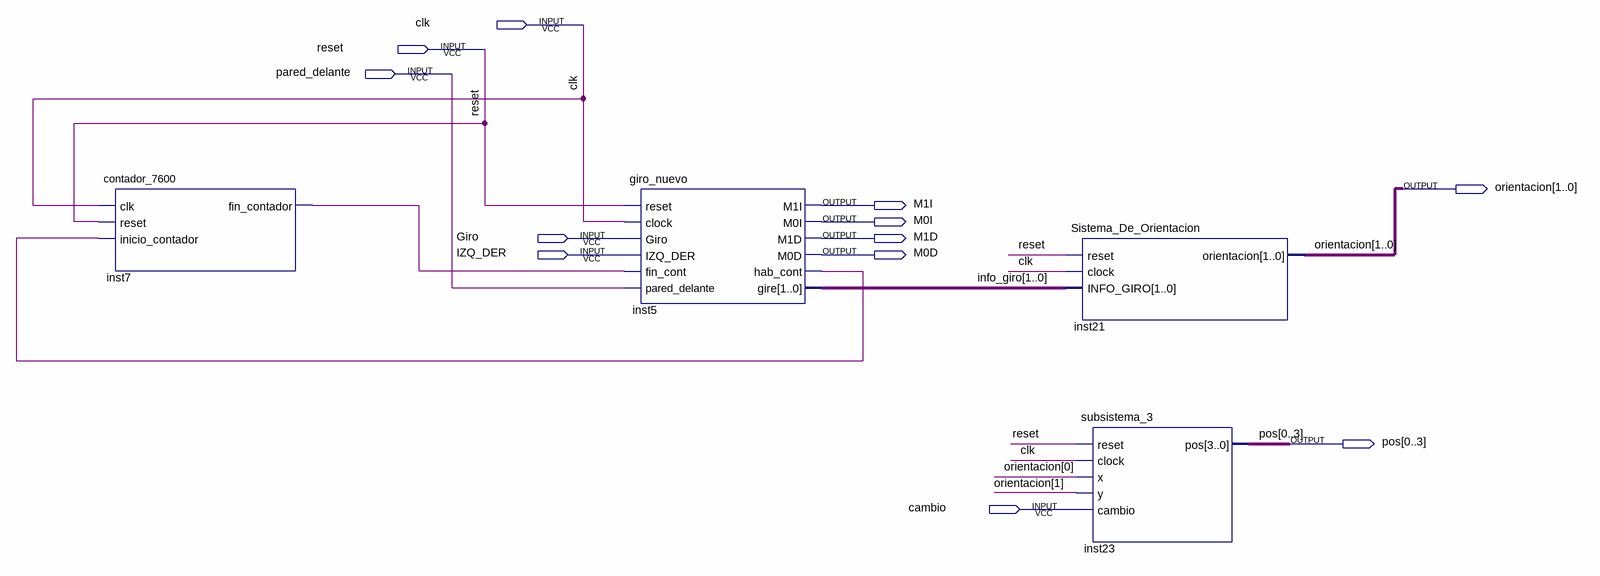
[diagram p0: schematic sheet]
// Quartus schematic prueba_giro.bdf as structural Verilog: 4 symbols, 12 pins
module prueba_giro (
  input  clk,
  input  reset,
  input  pared_delante,
  input  Giro,
  input  IZQ_DER,
  input  cambio,
  output [1:0] orientacion,
  output M1I,
  output M0I,
  output M1D,
  output M0D,
  output [0:3] pos
);

  wire inst5_hab_cont, inst7_fin_contador;
  wire [1:0] info_giro;

  contador_7600 inst7 (.clk(clk), .reset(reset), .inicio_contador(inst5_hab_cont), .fin_contador(inst7_fin_contador));
  giro_nuevo inst5 (
    .reset(reset), .clock(clk), .Giro(Giro), .IZQ_DER(IZQ_DER), .fin_cont(inst7_fin_contador),
    .pared_delante(pared_delante), .M1I(M1I), .M0I(M0I), .M1D(M1D), .M0D(M0D), .hab_cont(inst5_hab_cont),
    .gire(info_giro));
  Sistema_De_Orientacion inst21 (.reset(reset), .clock(clk), .INFO_GIRO(info_giro), .orientacion(orientacion));
  subsistema_3 inst23 (.reset(reset), .clock(clk), .x(orientacion[0]), .y(orientacion[1]), .cambio(cambio), .pos(pos));
endmodule
